# Altium schematic sheet МПСУ.464421.22-01.01 Sheet1.SchDoc
size 420 x 297 mm; DrawnBy: Лазба; Address1: Address1; Address2: Address2; Address3: Address3; Address4: Address4; SheetNumber: 1; SheetTotal: 1; DocumentName2SCH: Схема электрическая; DocumentName3SCH: принципиальная; UtverjdenNumberSCH: МПСУ.464414.22-01-УД; UtverjdenSCH: Утвержден; DocumentTypeSCH: Э3
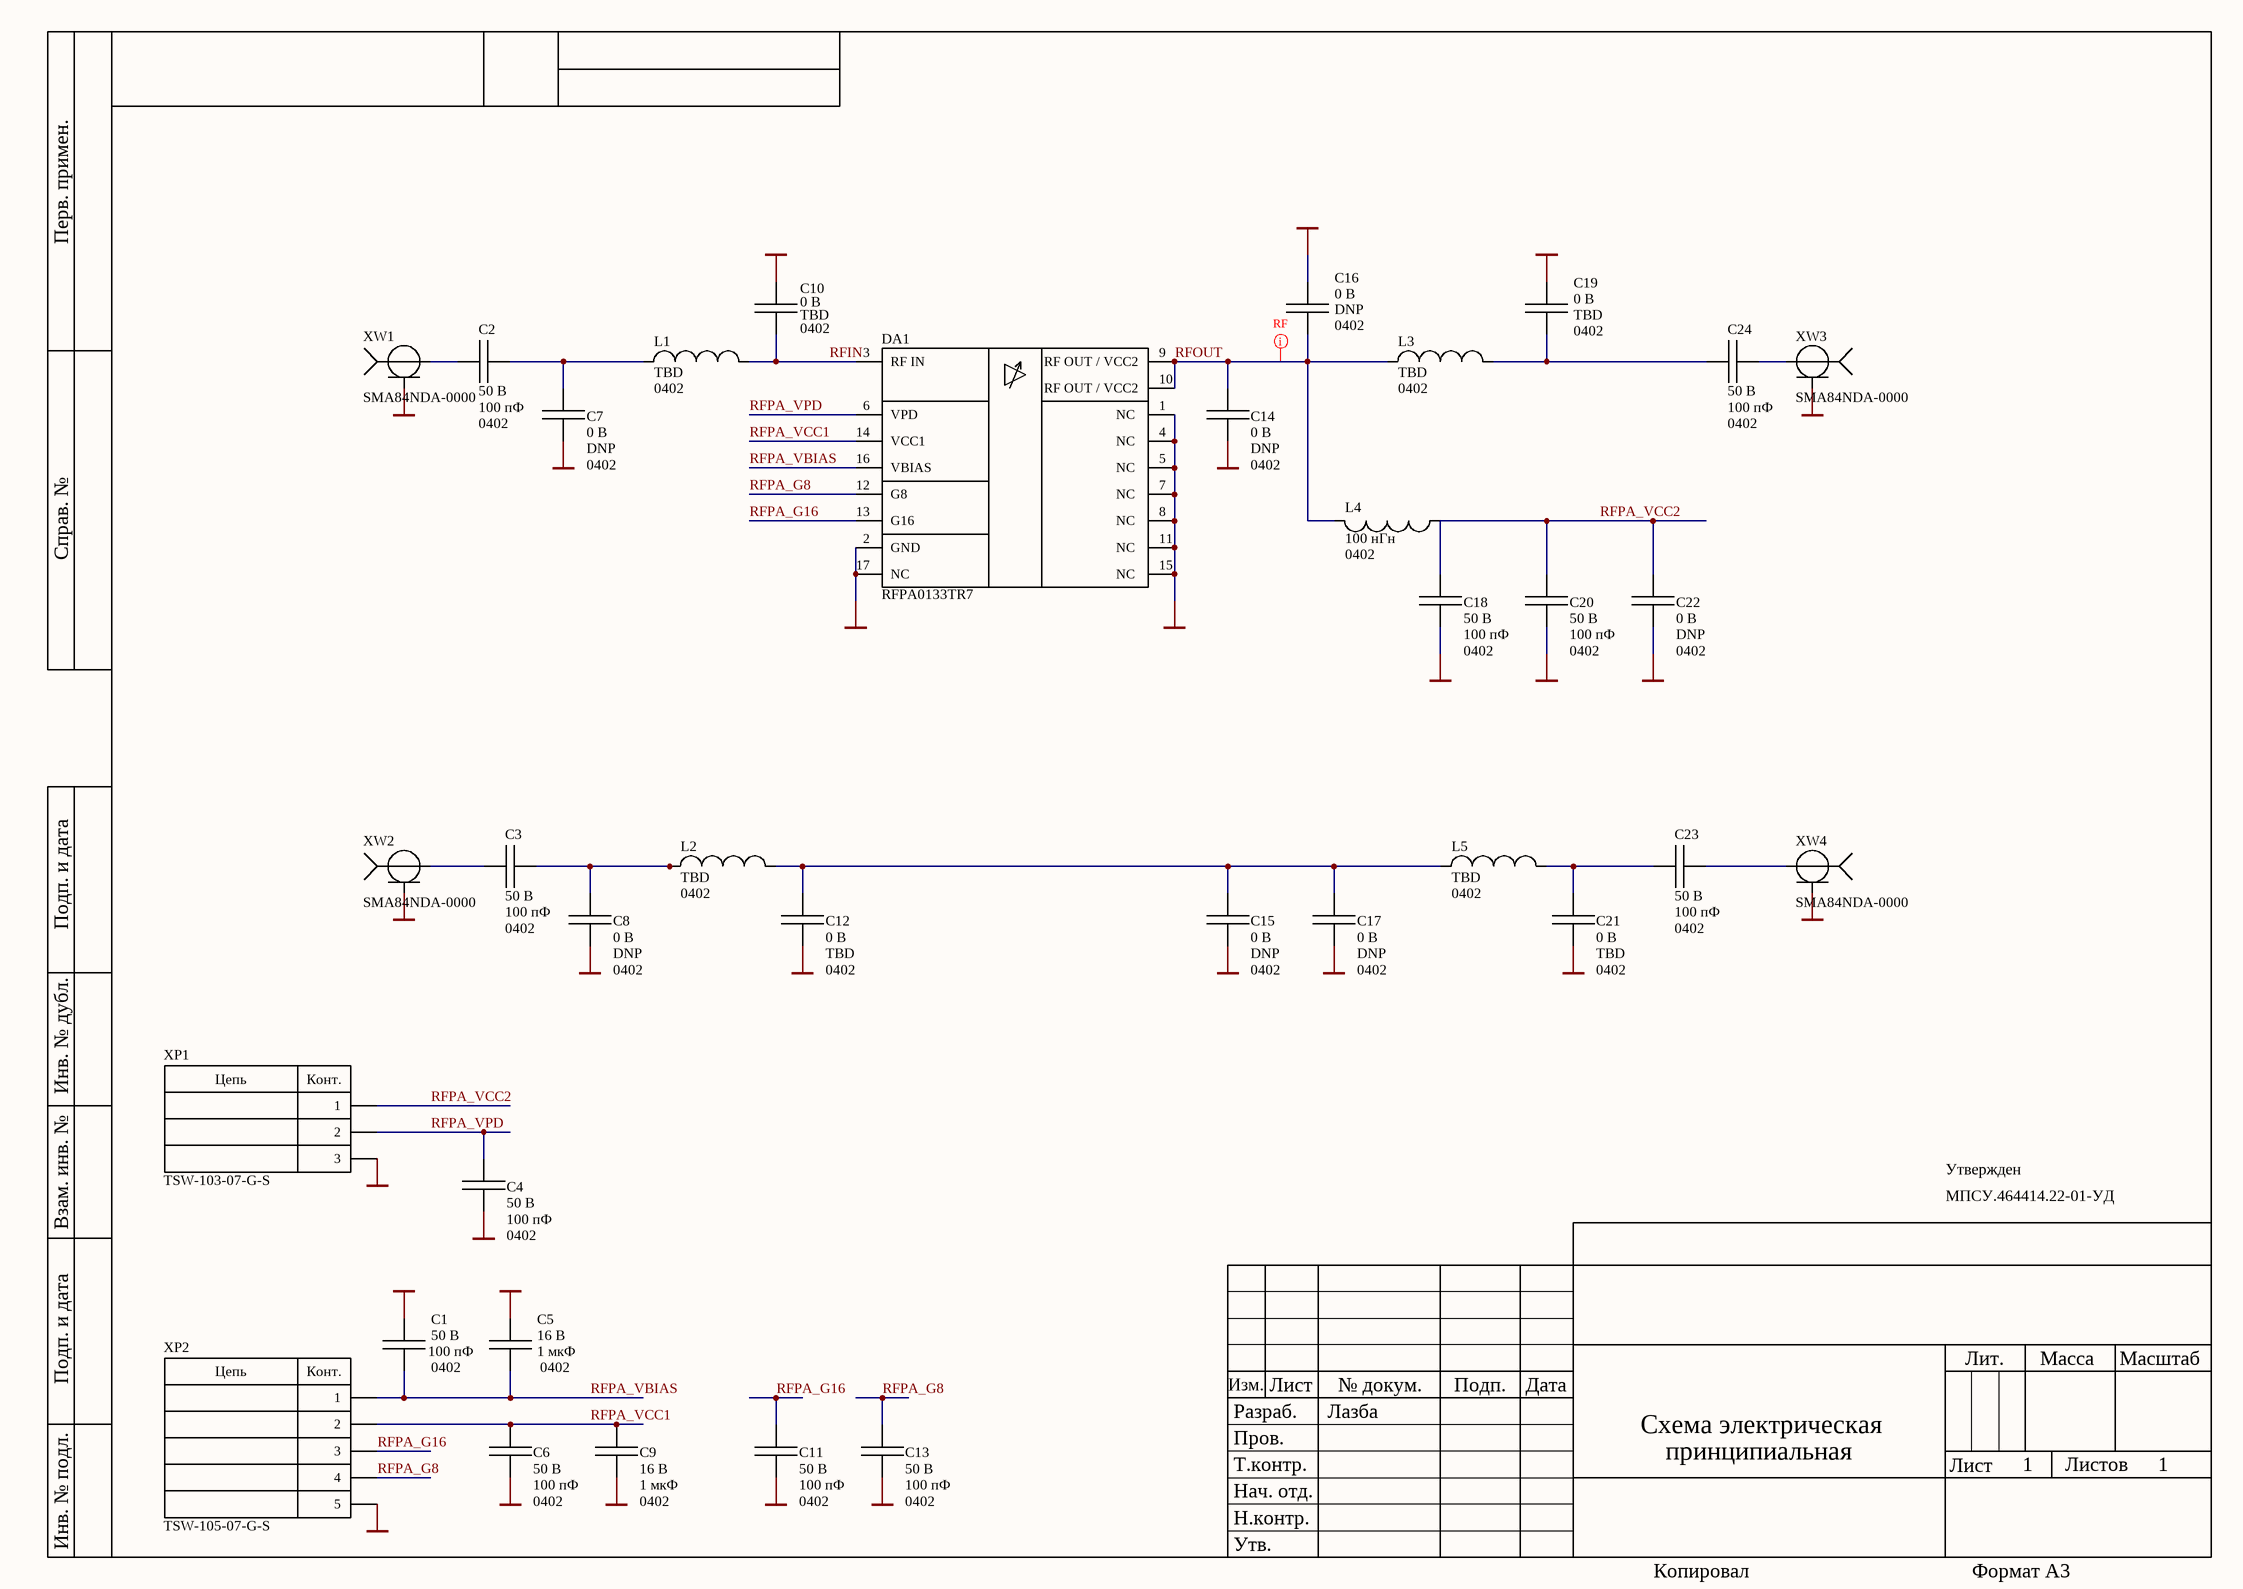
[diagram p0: МПСУ.464421.22-01.01 Sheet1.SchDoc]

## Parts
C1  value 100 пФ  Peak_Condition: 50 В  Package: 0402  [CAPC100X50X55L20N]  (hidden comment: 100 пФ ± 5 % 50 В C0G 0402 GRM1555C1H101JZ01D)
C2  value 100 пФ  Peak_Condition: 50 В  Package: 0402  [CAPC100X50X55L20N]  (hidden comment: 100 пФ ± 5 % 50 В C0G 0402 GRM1555C1H101JZ01D)
C3  value 100 пФ  Peak_Condition: 50 В  Package: 0402  [CAPC100X50X55L20N]  (hidden comment: 100 пФ ± 5 % 50 В C0G 0402 GRM1555C1H101JZ01D)
C4  value 100 пФ  Peak_Condition: 50 В  Package: 0402  [CAPC100X50X55L20N]  (hidden comment: 100 пФ ± 5 % 50 В C0G 0402 GRM1555C1H101JZ01D)
C5  value 1 мкФ  Peak_Condition: 16 В  Package: 0402  [CAPC100X50X55L20N]  (hidden comment: 1 мкФ ± 10 % 16 В X5R 0402 GRM155R61C105KA12D)
C6  value 100 пФ  Peak_Condition: 50 В  Package: 0402  [CAPC100X50X55L20N]  (hidden comment: 100 пФ ± 5 % 50 В C0G 0402 GRM1555C1H101JZ01D)
C7  value DNP  Peak_Condition: 0 В  Package: 0402  [CAPC100X50X55L20N]  (hidden comment: DNP 0402)
C8  value DNP  Peak_Condition: 0 В  Package: 0402  [CAPC100X50X55L20N]  (hidden comment: DNP 0402)
C9  value 1 мкФ  Peak_Condition: 16 В  Package: 0402  [CAPC100X50X55L20N]  (hidden comment: 1 мкФ ± 10 % 16 В X5R 0402 GRM155R61C105KA12D)
C10  value TBD  Peak_Condition: 0 В  Package: 0402  [CAPC100X50X55L20N]  (hidden comment: TBD 0402)
C11  value 100 пФ  Peak_Condition: 50 В  Package: 0402  [CAPC100X50X55L20N]  (hidden comment: 100 пФ ± 5 % 50 В C0G 0402 GRM1555C1H101JZ01D)
C12  value TBD  Peak_Condition: 0 В  Package: 0402  [CAPC100X50X55L20N]  (hidden comment: TBD 0402)
C13  value 100 пФ  Peak_Condition: 50 В  Package: 0402  [CAPC100X50X55L20N]  (hidden comment: 100 пФ ± 5 % 50 В C0G 0402 GRM1555C1H101JZ01D)
C14  value DNP  Peak_Condition: 0 В  Package: 0402  [CAPC100X50X55L20N]  (hidden comment: DNP 0402)
C15  value DNP  Peak_Condition: 0 В  Package: 0402  [CAPC100X50X55L20N]  (hidden comment: DNP 0402)
C16  value DNP  Peak_Condition: 0 В  Package: 0402  [CAPC100X50X55L20N]  (hidden comment: DNP 0402)
C17  value DNP  Peak_Condition: 0 В  Package: 0402  [CAPC100X50X55L20N]  (hidden comment: DNP 0402)
C18  value 100 пФ  Peak_Condition: 50 В  Package: 0402  [CAPC100X50X55L20N]  (hidden comment: 100 пФ ± 5 % 50 В C0G 0402 GRM1555C1H101JZ01D)
C19  value TBD  Peak_Condition: 0 В  Package: 0402  [CAPC100X50X55L20N]  (hidden comment: TBD 0402)
C20  value 100 пФ  Peak_Condition: 50 В  Package: 0402  [CAPC100X50X55L20N]  (hidden comment: 100 пФ ± 5 % 50 В C0G 0402 GRM1555C1H101JZ01D)
C21  value TBD  Peak_Condition: 0 В  Package: 0402  [CAPC100X50X55L20N]  (hidden comment: TBD 0402)
C22  value DNP  Peak_Condition: 0 В  Package: 0402  [CAPC100X50X55L20N]  (hidden comment: DNP 0402)
C23  value 100 пФ  Peak_Condition: 50 В  Package: 0402  [CAPC100X50X55L20N]  (hidden comment: 100 пФ ± 5 % 50 В C0G 0402 GRM1555C1H101JZ01D)
C24  value 100 пФ  Peak_Condition: 50 В  Package: 0402  [CAPC100X50X55L20N]  (hidden comment: 100 пФ ± 5 % 50 В C0G 0402 GRM1555C1H101JZ01D)
DA1  RFPA0133TR7  [QFN50P300X300X90_HS-17N]
L1  value TBD  Package: 0402  [INDC100X50X60L10N]  (hidden comment: TBD 0402)
L2  value TBD  Package: 0402  [INDC100X50X60L10N]  (hidden comment: TBD 0402)
L3  value TBD  Package: 0402  [INDC100X50X60L10N]  (hidden comment: TBD 0402)
L4  value 100 нГн  Package: 0402  [INDC100X50X60L10N]  (hidden comment: 100 нГн ± 5 % 200 мА 0402 LQG15HNR10J02D)
L5  value TBD  Package: 0402  [INDC100X50X60L10N]  (hidden comment: TBD 0402)
XP1  TSW-103-07-G-S  [TSW-103-07-G-S]
XP2  TSW-105-07-G-S  [TSW-105-07-G-S]
XW1  SMA84NDA-0000  [SMA84NDA-0000]
XW2  SMA84NDA-0000  [SMA84NDA-0000]
XW3  SMA84NDA-0000  [SMA84NDA-0000]
XW4  SMA84NDA-0000  [SMA84NDA-0000]

## Nets
GND: C1.1 C4.1 C5.1 C6.1 C7.2 C8.2 C9.1 C10.2 C11.1 C12.2 C13.1 C14.2 C15.1 C16.1 C17.2 C18.2 C19.2 C20.2 C21.2 C22.2 DA1.1(NC) DA1.2(GND) DA1.4(NC) DA1.5(NC) DA1.7(NC) DA1.8(NC) DA1.11(NC) DA1.15(NC) DA1.17(NC) XP1.3 XP2.5 XW1.2(GND) XW2.2(GND) XW3.2(GND) XW4.2(GND)
RFIN: C10.1 DA1.3(RF_IN) L1.2
RFOUT: C14.1 C16.2 DA1.9(RF_OUT_/_VCC2) DA1.10(RF_OUT_/_VCC2) L3.1 L4.2
RFPA_G8: C13.2 DA1.12(G8) XP2.4
RFPA_G16: C11.2 DA1.13(G16) XP2.3
RFPA_VBIAS: C1.2 C5.2 DA1.16(VBIAS) XP2.1
RFPA_VCC2: C18.1 C20.1 C22.1 L4.1 XP1.1
RFPA_VPD: C4.2 DA1.6(VPD) XP1.2
RFPA_VСС1: C6.2 C9.2 DA1.14(VCC1) XP2.2
NetC2_1: C2.1 XW1.1(RF)
NetC2_2: C2.2 C7.1 L1.1
NetC3_1: C3.1 XW2.1(RF)
NetC3_2: C3.2 C8.1 L2.1
NetC12_1: C12.1 C15.2 C17.1 L2.2 L5.1
NetC19_1: C19.1 C24.1 L3.2
NetC21_1: C21.1 C23.1 L5.2
NetC23_2: C23.2 XW4.1(RF)
NetC24_2: C24.2 XW3.1(RF)

## Layout directives
net class RF: RFOUT

## Notes on the sheet
- Перв. примен.
- Справ. №
- Подп. и дата
- Инв. № дубл.
- Взам. инв. №
- Разраб.
- Изм.
- Лист
- № докум.
- Подп.
- Дата
- Лит.
- Масса
- Масштаб
- Пров.
- Т.контр.
- Листов
- Инв. № подл.
- Утв.
- Н.контр.
- Нач. отд.
- Копировал
- Формат А3
- (in symbol TSW-103-07-G-S) Цепь; Конт.
- (in symbol TSW-105-07-G-S) Цепь; Конт.

## Library data of the parts
C1-C4 C6 C11 C13 C18 C20 C23 C24 = C 0402: Capacitor 0402; Manufacturer: Murata; Tolerance: 5 %; Designer: Свидерский; 3D_Body: +; PartNumber: GRM1555C1H101JZ01D; Category: Passive; Subcategory: Capacitor; Dielectric: C0G; Status: Approved
C5 C9 = C 0402: Capacitor 0402; Manufacturer: Murata; Tolerance: 10 %; Designer: Свидерский; 3D_Body: +; PartNumber: GRM155R61C105KA12D; Category: Passive; Subcategory: Capacitor; Dielectric: X5R; Status: Approved
C7 C8 C10 C12 C14-C17 C19 C21 C22 = C 0402: Capacitor 0402; Tolerance: 0 %; Designer: Свидерский; Notes: CP; 3D_Body: +; Category: Passive; Subcategory: Capacitor; Status: Approved
DA1 = RFPA0133TR7: 380 to 960 MHz, 3 to 5V programmable gain high efficiency power amplifier; Manufacturer: RFD, Qorvo; Designer: Лазба; 3D_Body: +; ComponentLink1Description: Техническое описание; ComponentLink1URL: Q:\Libs\Descriptions_PDF\RFPA0133_data_sheet.pdf; Category: IC; Subcategory: VGA; Status: Check; Package: 16-Lead QFN; PartNumber: RFPA0133TR7
L1-L3 L5 = L 0402: Inductor 0402; Designer: Свидерский; Notes: CP; 3D_Body: +; Tolerance: 0 %; Peak_Condition: 0 А; Category: Passive; Subcategory: Inductor; Status: Approved
L4 = L 0402: Inductor 0402; Manufacturer: Murata; Designer: Свидерский; 3D_Body: +; Tolerance: 5 %; Peak_Condition: 200 мА; PartNumber: LQG15HNR10J02D; Category: Passive; Subcategory: Inductor; Status: Approved
XP1 = TSW-103-07-G-S: Вилка 2,54 мм; Manufacturer: Samtec; System: Connector; 3D_Body: +; Designer: Затонская; Pitch: 2.54mm; ComponentLink1Description: Техническое описание; ComponentLink1URL: Q:\Libs\Descriptions_PDF\tsw_th.pdf; Category: Connector; Subcategory: Male; Status: Check; Pins: 1x3; PartNumber: TSW-103-07-G-S
XP2 = TSW-105-07-G-S: Вилка 2,54 мм; Manufacturer: Samtec; System: Connector; 3D_Body: +; Designer: Затонская; Pitch: 2.54mm; ComponentLink1Description: Техническое описание; ComponentLink1URL: Q:\Libs\Descriptions_PDF\tsw_th.pdf; Category: Connector; Subcategory: Male; Status: Check; Pins: 1x5; PartNumber: TSW-105-07-G-S
XW1-XW4 = SMA84NDA-0000: SMA Jack P.C.B Mount (End Launch) 50 Ohm; Manufacturer: Jyebao; 3D_Body: +; Designer: Карпов; Pitch: 3.5mm; System: Connector; ComponentLink1Description: Техническое описание; ComponentLink1URL: Q:/Libs/Descriptions_PDF/SMA84NDA-0000.pdf; Category: Connector; Subcategory: RF; Pins: Coax; Status: Approved; PartNumber: SMA84NDA-0000